# Altium project Thrust.PrjPcb
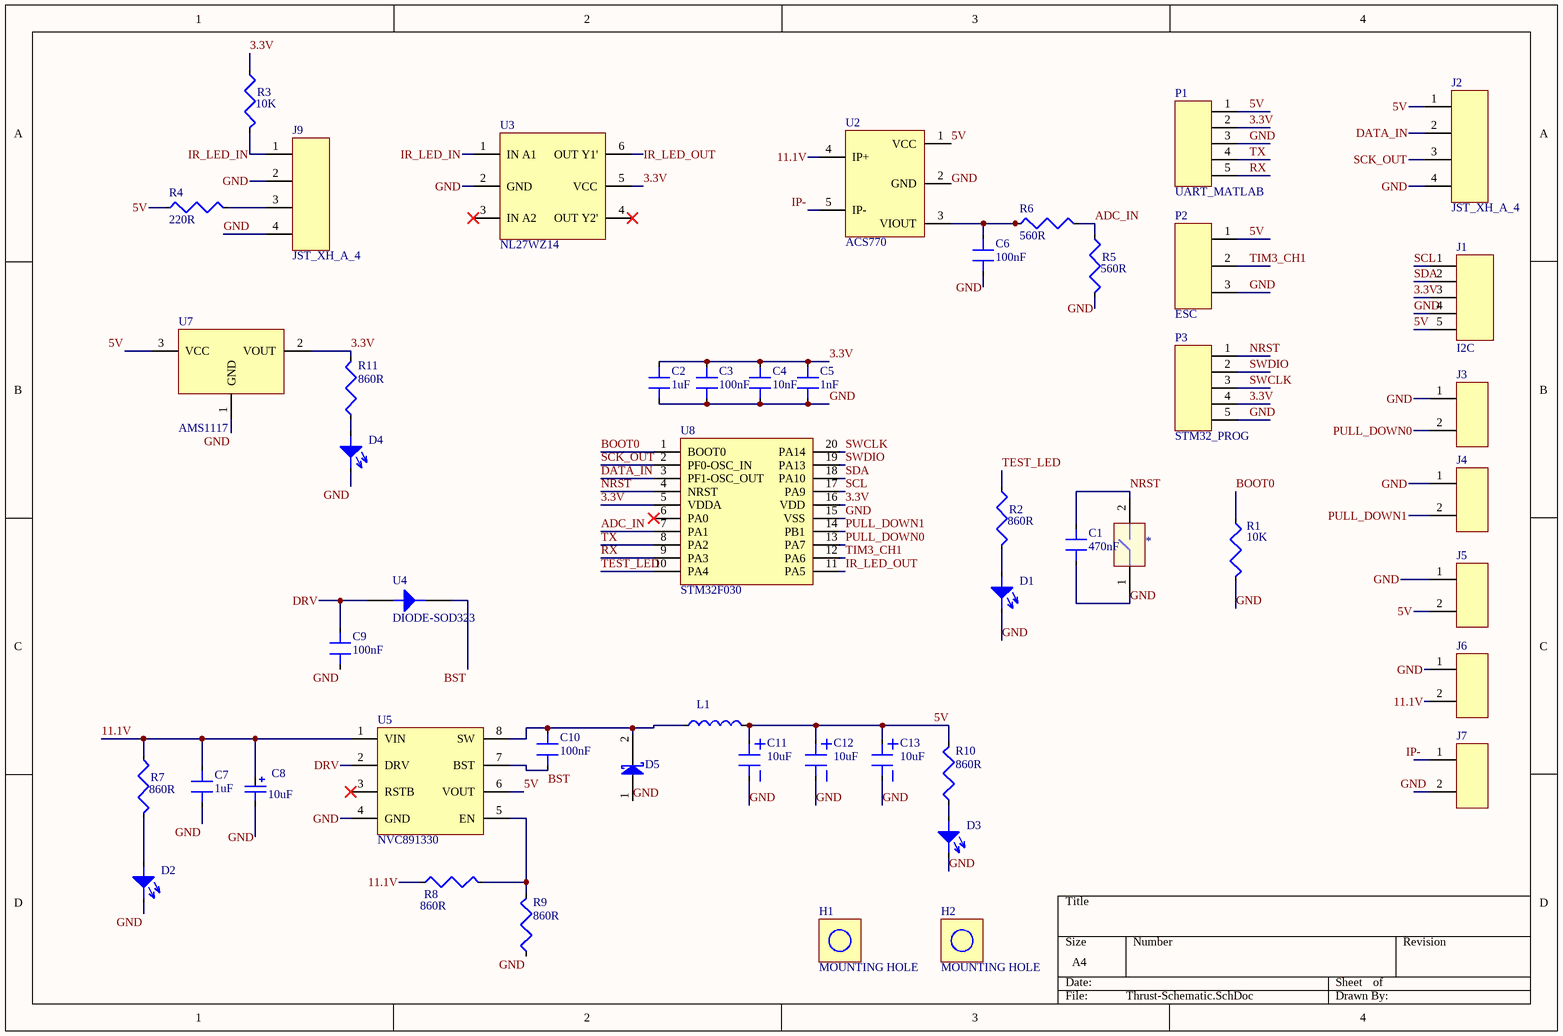
[diagram p0: Thrust-Schematic.SchDoc]
1 sheet, 50 parts. Net scope: global (net labels, ports and power ports of the same name join across sheets).
Board file: ThrustLayout.PcbDoc

## Sheet Thrust-Schematic.SchDoc
size A4

### Parts
*  SWITCH  [SWITCH]  (value not drawn)
C1  470nF  [RES0805]
C2  1uF  [RES0805]
C3  100nF  [RES0805]
C4  10nF  [RES0805]
C5  1nF  [RES0805]
C6  100nF  [RES0805]
C7  1uF  [RES0805]
C8  10uF  [Cap_4x5.4_SMD]
C9  100nF  [RES0805]
C10  100nF  [RES0805]
C11  10uF  [CAP_THT]
C12  10uF  [CAP_THT]
C13  10uF  [CAP_THT]
D1  LED0805  [RES0805]  (value not drawn)
D2  LED0805  [RES0805]  (value not drawn)
D3  LED0805  [RES0805]  (value not drawn)
D4  LED0805  [RES0805]  (value not drawn)
D5  Diode  [Schottky]  (value not drawn)
H1  MOUNTING HOLE  [MOUNTING HOLE]
H2  MOUNTING HOLE  [MOUNTING HOLE]
J1  I2C  [JST_XH_A_5]
J2  JST_XH_A_4  [JST_XH_A_4]
J3  JST_XH_A_2  [JST_XH_A_2]  (value not drawn)
J4  JST_XH_A_2  [JST_XH_A_2]  (value not drawn)
J5  JST_XH_A_2  [JST_XH_A_2]  (value not drawn)
J6  XT60  [XT60]  (value not drawn)
J7  XT60  [XT60]  (value not drawn)
J9  JST_XH_A_4  [JST_XH_A_4]
L1  INDUCTOR  [IND-IHLP-1212BZ-11]  (value not drawn)
P1  UART_MATLAB  [Pin_Header_1x5]
P2  ESC  [Pin_Header_1x3]
P3  STM32_PROG  [Pin_Header_1x5]
R1  10K  [RES0805]
R2  860R  [RES0805]
R3  10K  [RES0805]
R4  220R  [RES0805]
R5  560R  [RES0805]
R6  560R  [RES0805]
R7  860R  [RES0805]
R8  860R  [RES0805]
R9  860R  [RES0805]
R10  860R  [RES0805]
R11  860R  [RES0805]
U2  ACS770  [ACS770]
U3  NL27WZ14  [TSOP6]
U4  DIODE-SOD323  [SODFL250X100-2N]
U5  NVC891330  [SOIC8]
U7  AMS1117  [SOT223]
U8  STM32F030  [TSOP20]

### Nets
3.3V: C2.1 C3.1 C4.1 C5.1 J1.3 P1.2 P3.4 R3.2 R11.1 U3.5(VCC) U7.2(VOUT) U8.5(VDDA) U8.16(VDD)
5V: C11.1 C12.1 C13.1 J1.5 J2.1 J5.2 L1.2 P1.1 P2.1 R4.2 R10.1 U2.1(VCC) U5.6(VOUT) U7.3(VCC)
11.1V: C7.2 C8.1 J6.2(BOOT16) R7.2 R8.2 U2.4(IP+) U5.1(VIN)
ADC_IN: R5.2 R6.1 U8.7(PA1)
BOOT0: R1.2 U8.1(BOOT0)
BST: C10.1 U4.2(?) U5.7(BST)
DATA_IN: J2.2 U8.3(PF1-OSC_OUT)
DRV: C9.2 U4.1(?) U5.2(DRV)
GND: *.1 C1.1 C2.2 C3.2 C4.2 C5.2 C6.2 C7.1 C8.2 C9.1 C11.2 C12.2 C13.2 D1.2 D2.2 D3.2 D4.2 D5.1 J1.4 J2.4 J3.1 J4.1 J5.1 J6.1(BOOT15) J7.2(BOOT16) J9.2 J9.4 P1.3 P2.3 P3.5 R1.1 R5.1 R9.2 U3.2(GND) U5.4(GND) U7.1(GND) U8.15(VSS)
IP-: J7.1(BOOT15) U2.5(IP-)
IR_LED_IN: J9.1 R3.1 U3.1(IN_A1)
IR_LED_OUT: U3.6(OUT_Y1') U8.11(PA5)
NRST: *.2 C1.2 P3.1 U8.4(NRST)
PULL_DOWN0: J3.2 U8.13(PA7)
PULL_DOWN1: J4.2 U8.14(PB1)
RX: P1.5 U8.9(PA3)
SCK_OUT: J2.3 U8.2(PF0-OSC_IN)
SCL: J1.1 U8.17(PA9)
SDA: J1.2 U8.18(PA10)
SWCLK: P3.3 U8.20(PA14)
SWDIO: P3.2 U8.19(PA13)
TEST_LED: R2.2 U8.10(PA4)
TIM3_CH1: P2.2 U8.12(PA6)
TX: P1.4 U8.8(PA2)
NetC6_1: C6.1 R6.2 U2.3(VIOUT)
NetC10_2: C10.2 D5.2 L1.1 U5.8(SW)
NetD1_1: D1.1 R2.1
NetD2_1: D2.1 R7.1
NetD3_1: D3.1 R10.2
NetD4_1: D4.1 R11.2
NetJ9_3: J9.3 R4.1
NetR8_1: R8.1 R9.1 U5.5(EN)

Not connected (* = marked no-connect by the designer): U2 2(GND); U3 3(IN_A2)* 4(OUT_Y2')*; U5 3(RSTB)*; U8 6(PA0)*

### Notes on the sheet
- Labels drawn without touching a wire or pin: GND

### Library data of the parts
C1-C7 C9 C10 = CAP0805
C8 = SMD_Cap_4x5.4
C11-C13 = CAP_THT
D5 = Schottyky Diode: Schottky Diode
J1 = JST_XH_A_5
L1 = INDUCTOR: IHLP-1212BZ-11
P1 P3 = Pin_Header_1x5
P2 = Pin_Header_1x3
R1-R11 = RES0805